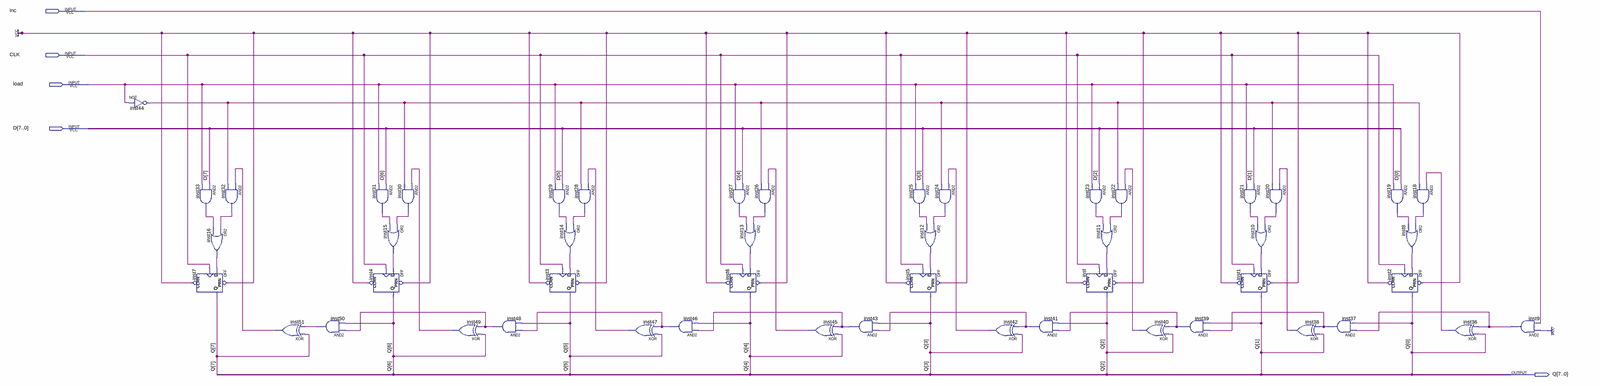
[diagram p0: schematic sheet, whole]
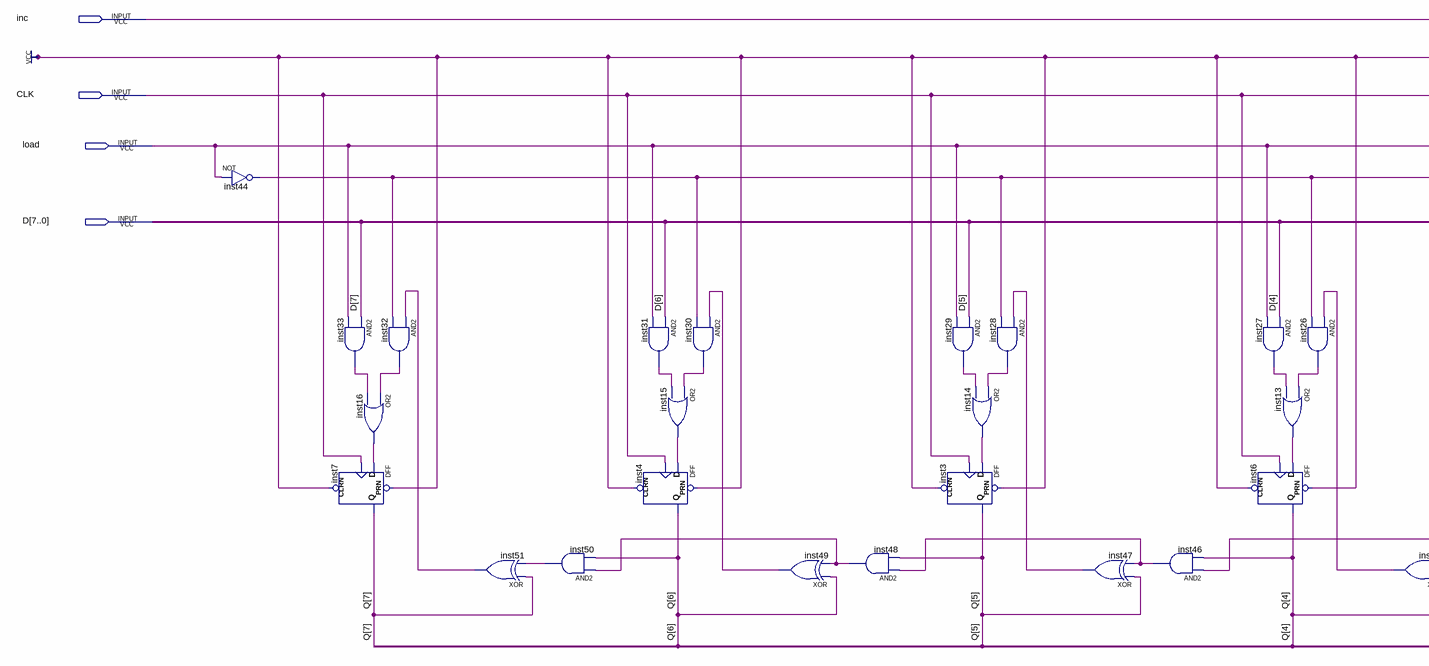
[diagram p1: schematic sheet, left part]
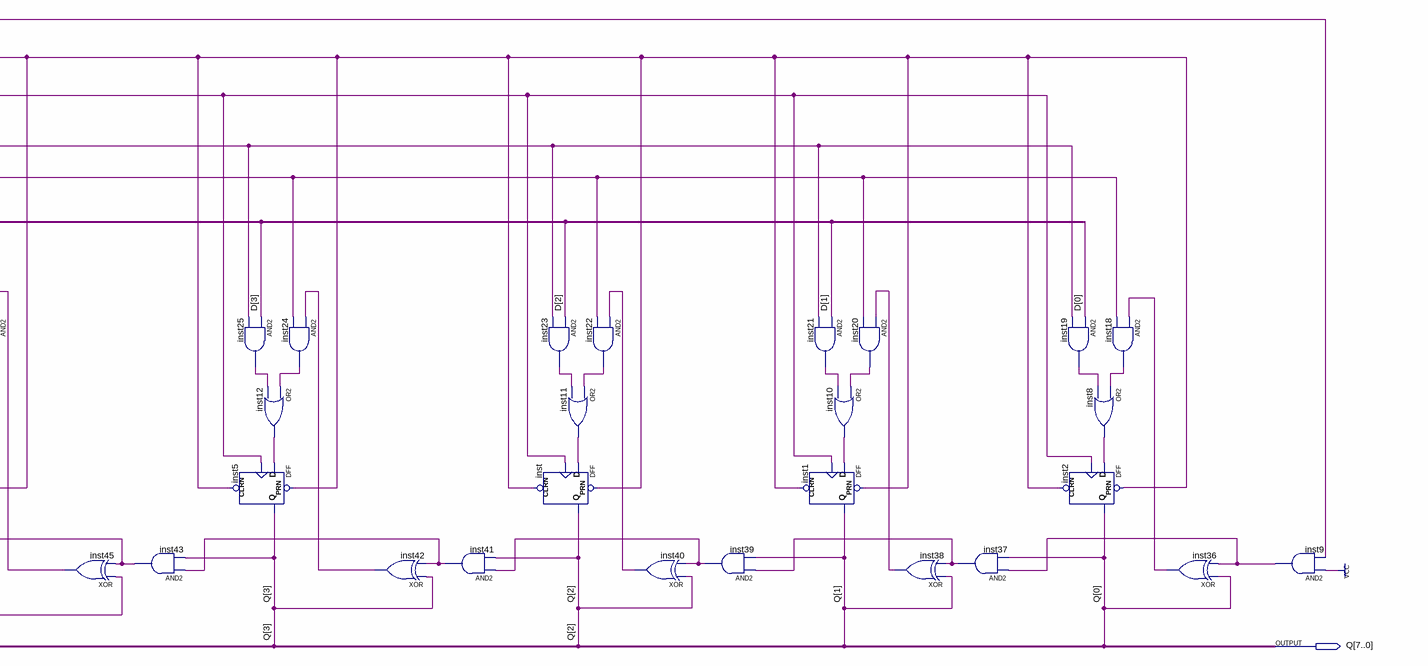
[diagram p2: schematic sheet, right part]
// Quartus schematic pc.bdf as structural Verilog: 49 symbols, 5 pins
module pc (
  input  inc,
  input  CLK,
  input  load,
  input  [7:0] D,
  output [7:0] Q
);

  wire inst8_out, inst9_out, inst10_out, inst11_out, inst12_out, inst13_out, inst14_out, inst15_out,
       inst16_out, inst18_out, inst19_out, inst20_out, inst21_out, inst22_out, inst23_out, inst24_out,
       inst25_out, inst26_out, inst27_out, inst28_out, inst29_out, inst30_out, inst31_out, inst32_out,
       inst33_out, inst36_out, inst37_out, inst38_out, inst39_out, inst40_out, inst41_out, inst42_out,
       inst43_out, inst44_out, inst45_out, inst46_out, inst47_out, inst48_out, inst49_out, inst50_out,
       inst51_out;

  not inst44 (inst44_out, load);
  and inst33 (inst33_out, D[7], load);
  or inst16 (inst16_out, inst32_out, inst33_out);
  DFF inst7 (.CLRN(1'b1), .CLK(CLK), .D(inst16_out), .PRN(1'b1), .Q(Q[7]));
  and inst32 (inst32_out, inst51_out, inst44_out);
  xor inst51 (inst51_out, Q[7], inst50_out);
  and inst50 (inst50_out, inst48_out, Q[6]);
  and inst31 (inst31_out, D[6], load);
  or inst15 (inst15_out, inst30_out, inst31_out);
  DFF inst4 (.CLRN(1'b1), .CLK(CLK), .D(inst15_out), .PRN(1'b1), .Q(Q[6]));
  and inst30 (inst30_out, inst49_out, inst44_out);
  xor inst49 (inst49_out, Q[6], inst48_out);
  and inst48 (inst48_out, inst46_out, Q[5]);
  and inst29 (inst29_out, D[5], load);
  or inst14 (inst14_out, inst28_out, inst29_out);
  DFF inst3 (.CLRN(1'b1), .CLK(CLK), .D(inst14_out), .PRN(1'b1), .Q(Q[5]));
  and inst28 (inst28_out, inst47_out, inst44_out);
  xor inst47 (inst47_out, Q[5], inst46_out);
  and inst46 (inst46_out, inst43_out, Q[4]);
  and inst27 (inst27_out, D[4], load);
  or inst13 (inst13_out, inst26_out, inst27_out);
  DFF inst6 (.CLRN(1'b1), .CLK(CLK), .D(inst13_out), .PRN(1'b1), .Q(Q[4]));
  and inst26 (inst26_out, inst45_out, inst44_out);
  xor inst45 (inst45_out, Q[4], inst43_out);
  and inst43 (inst43_out, inst41_out, Q[3]);
  and inst25 (inst25_out, D[3], load);
  or inst12 (inst12_out, inst24_out, inst25_out);
  DFF inst5 (.CLRN(1'b1), .CLK(CLK), .D(inst12_out), .PRN(1'b1), .Q(Q[3]));
  and inst24 (inst24_out, inst42_out, inst44_out);
  xor inst42 (inst42_out, Q[3], inst41_out);
  and inst41 (inst41_out, inst39_out, Q[2]);
  and inst23 (inst23_out, D[2], load);
  or inst11 (inst11_out, inst22_out, inst23_out);
  DFF inst (.CLRN(1'b1), .CLK(CLK), .D(inst11_out), .PRN(1'b1), .Q(Q[2]));
  and inst22 (inst22_out, inst40_out, inst44_out);
  xor inst40 (inst40_out, Q[2], inst39_out);
  and inst39 (inst39_out, inst37_out, Q[1]);
  and inst21 (inst21_out, D[1], load);
  DFF inst1 (.CLRN(1'b1), .CLK(CLK), .D(inst10_out), .PRN(1'b1), .Q(Q[1]));
  and inst20 (inst20_out, inst38_out, inst44_out);
  or inst10 (inst10_out, inst20_out, inst21_out);
  xor inst38 (inst38_out, Q[1], inst37_out);
  and inst37 (inst37_out, inst9_out, Q[0]);
  and inst19 (inst19_out, D[0], load);
  DFF inst2 (.CLRN(1'b1), .CLK(CLK), .D(inst8_out), .PRN(1'b1), .Q(Q[0]));
  and inst18 (inst18_out, inst36_out, inst44_out);
  or inst8 (inst8_out, inst18_out, inst19_out);
  xor inst36 (inst36_out, Q[0], inst9_out);
  and inst9 (inst9_out, 1'b1, inc);
endmodule
